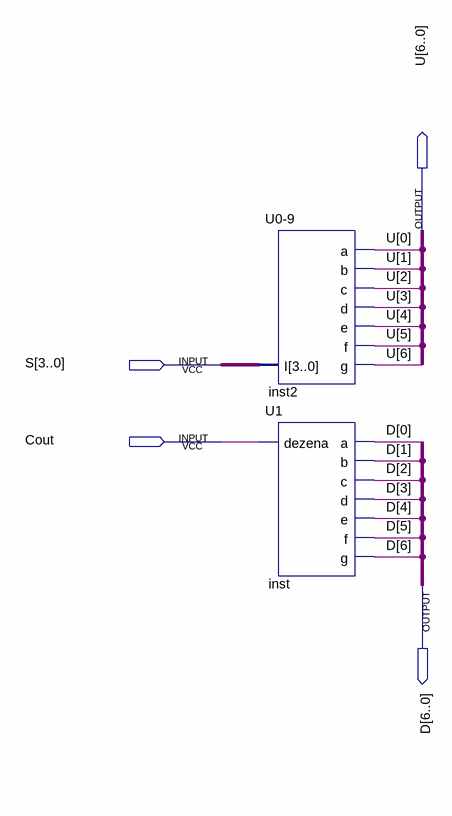
[diagram p0: schematic sheet]
// Quartus schematic DisplayBCD.bdf as structural Verilog: 2 symbols, 4 pins
module DisplayBCD (
  input  [3:0] S,
  input  Cout,
  output [6:0] U,
  output [6:0] D
);

  \U0-9  inst2 (.I(S), .a(U[0]), .b(U[1]), .c(U[2]), .d(U[3]), .e(U[4]), .f(U[5]), .g(U[6]));
  U1 inst (.dezena(Cout), .a(D[0]), .b(D[1]), .c(D[2]), .d(D[3]), .e(D[4]), .f(D[5]), .g(D[6]));
endmodule
